# EAGLE schematic FF-Adapters (EAGLE 7.0.0)
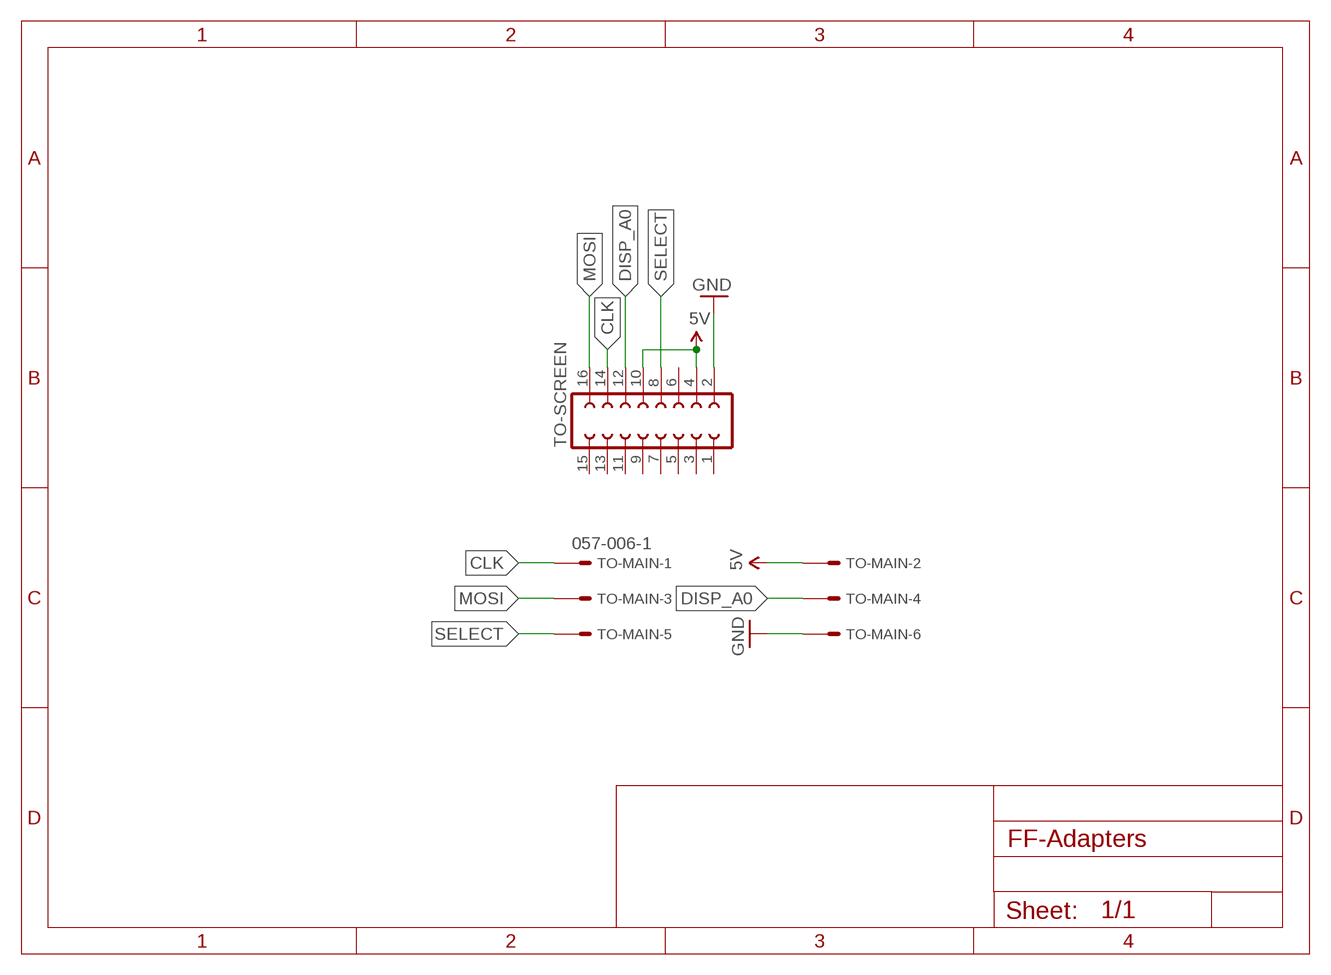
[diagram p0: schematic, sheet 1]

## Parts
TO-MAIN  057-006-1  [057-006-1]
TO-SCREEN  FE08-2  [FE08-2]

## Nets
5V [Power]: TO-MAIN.2 TO-SCREEN.4 TO-SCREEN.10
CLK [signal]: TO-MAIN.1 TO-SCREEN.14
DISP_A0 [signal]: TO-MAIN.4 TO-SCREEN.12
GND [Power]: TO-MAIN.6 TO-SCREEN.2
MOSI [signal]: TO-MAIN.3 TO-SCREEN.16
SELECT [signal]: TO-MAIN.5 TO-SCREEN.8
Unconnected: TO-SCREEN.1 TO-SCREEN.3 TO-SCREEN.5 TO-SCREEN.6 TO-SCREEN.7 TO-SCREEN.9 TO-SCREEN.11 TO-SCREEN.13 TO-SCREEN.15

## Library data of the parts
TO-MAIN = con-panduit:057-006-: CONNECTOR 6-pin series 057 contact pc board low profile headers; OC_FARNELL: unknown; OC_NEWARK: unknown
TO-SCREEN = con-lsta:FE08-2: FEMALE HEADER; OC_FARNELL: unknown; OC_NEWARK: unknown

## Net classes
1 Power: width 0.381 mm, drill 0.381 mm, clearance 0.381 mm
2 signal: width 0.254 mm, drill 0.254 mm, clearance 0.254 mm